# Altium schematic sheet Power Stage.SchDoc
size A4
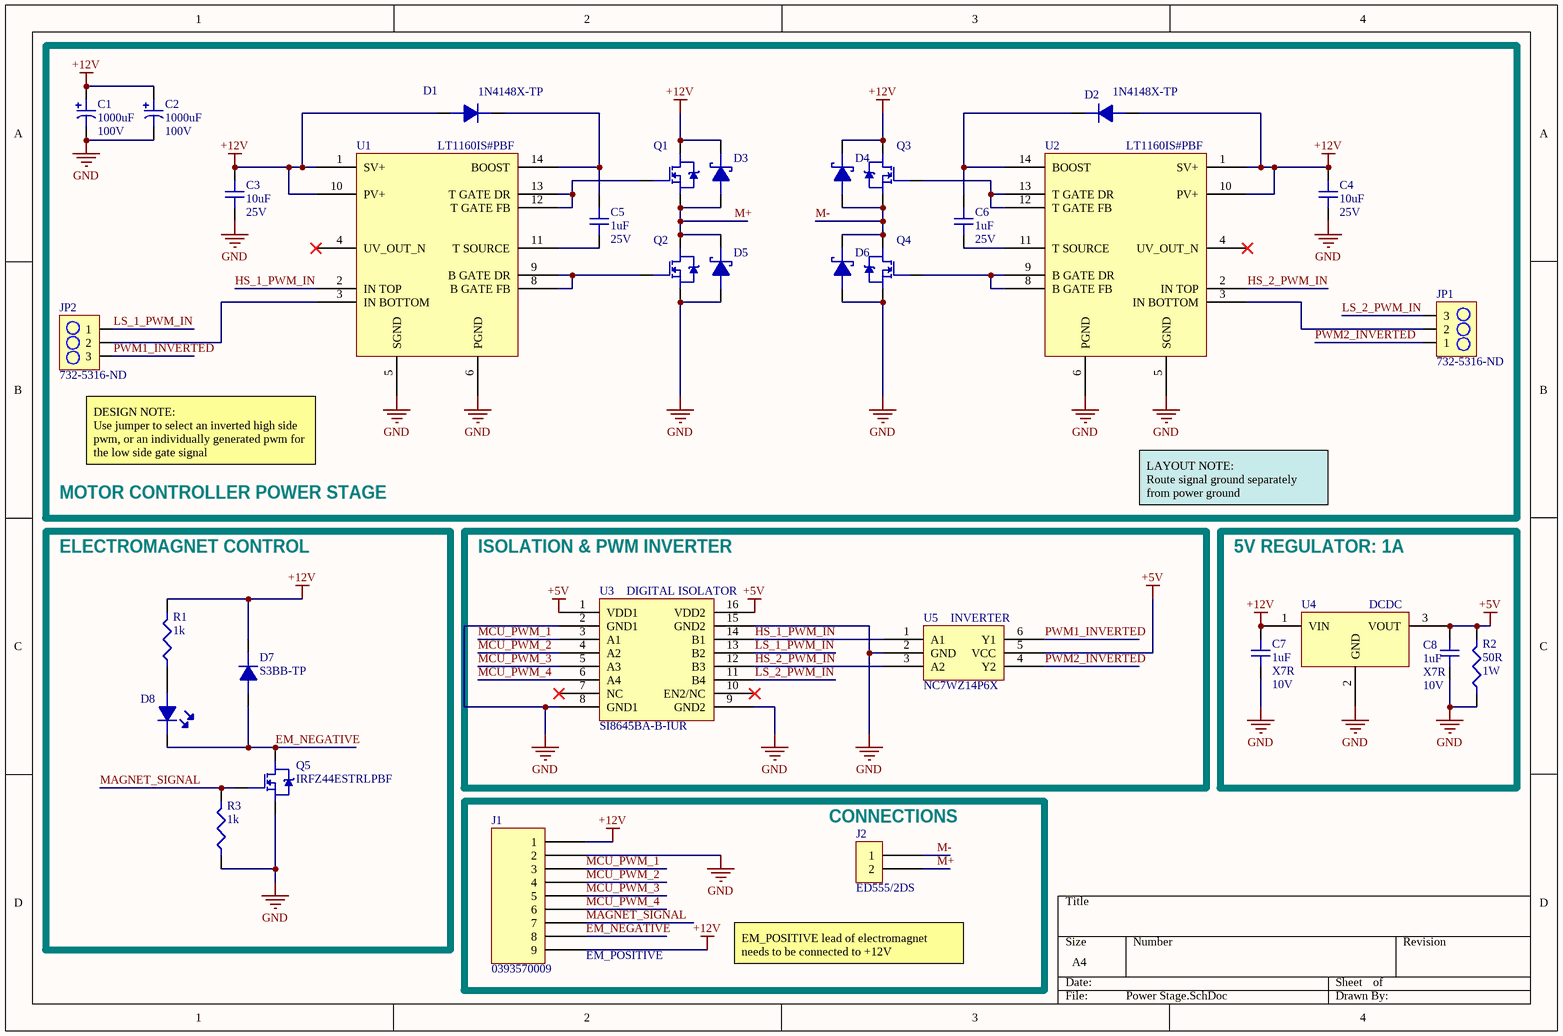
[diagram p0: Power Stage.SchDoc]

## Parts
C1  Capacitance: 1000uF  Voltage Rating: 100V  [CAP_THRU]  (hidden comment: UVR2A102MRD6)
C2  Capacitance: 1000uF  Voltage Rating: 100V  [CAP_THRU]  (hidden comment: UVR2A102MRD6)
C3  Capacitance: 10uF  Voltage Rating: 25V  [C1206]  (hidden comment: C3216X5R1E106K160AB)
C4  Capacitance: 10uF  Voltage Rating: 25V  [C1206]  (hidden comment: C3216X5R1E106K160AB)
C5  Voltage: 25V  [C0805]  (hidden comment: 1uF)
C6  Voltage: 25V  [C0805]  (hidden comment: 1uF)
C7  1uF  Dielectric: X7R  Voltage: 10V  [C0805]
C8  1uF  Dielectric: X7R  Voltage: 10V  [C0805]
D1  1N4148X-TP  [SOD523]
D2  1N4148X-TP  [SOD523]
D3  CDBA540-HF  [DO214-AC]  (value not drawn)
D4  CDBA540-HF  [DO214-AC]  (value not drawn)
D5  CDBA540-HF  [DO214-AC]  (value not drawn)
D6  CDBA540-HF  [DO214-AC]  (value not drawn)
D7  S3BB-TP  [DO-214AA_Diode]
D8  LTST-C191TBKT-5A  [LED_0603]  (value not drawn)
J1  0393570009  [9POS_CONNECTOR]
J2  ED555/2DS  [2POS_CONNECTOR]
JP1  732-5316-ND  [3PIN_HEADER]
JP2  732-5316-ND  [3PIN_HEADER]
Q1  IRFZ44ESTRLPBF  [D2PAK]  (value not drawn)
Q2  IRFZ44ESTRLPBF  [D2PAK]  (value not drawn)
Q3  IRFZ44ESTRLPBF  [D2PAK]  (value not drawn)
Q4  IRFZ44ESTRLPBF  [D2PAK]  (value not drawn)
Q5  IRFZ44ESTRLPBF  [D2PAK]
R1  1k  [R0805]
R2  50R  Power Rating: 1W  [R2512]
R3  1k  [R0805]
U1  LT1160IS#PBF  [SOIC-14]
U2  LT1160IS#PBF  [SOIC-14]
U3  SI8645BA-B-IUR  [QSOP-16]
U4  DCDC  [DCDC]
U5  NC7WZ14P6X  [TSOP-6]

## Blocks framed on the sheet
MOTOR CONTROLLER POWER STAGE: C1-C6 D1-D6 JP1 JP2 Q1-Q4 U1 U2
ELECTROMAGNET CONTROL: D7 D8 Q5 R1 R3
ISOLATION & PWM INVERTER: U3 U5
5V REGULATOR: 1A: C7 C8 R2 U4
CONNECTIONS: J1 J2

## Nets
+5V: C8.2 R2.2 U3.1(VDD1) U3.16(VDD2) U4.3(VOUT) U5.5(VCC)
+12V: C1.1 C2.1 C3.2 C4.2 C7.2 D1.1 D2.1 D3.2 D4.2 D7.2 J1.1 J1.9 Q1.2 Q3.2 R1.2 U1.1(SV+) U1.10(PV+) U2.1(SV+) U2.10(PV+) U4.1(VIN)
GND: C1.2 C2.2 C3.1 C4.1 C7.1 C8.1 D5.1 D6.1 J1.2 Q2.3 Q4.3 Q5.3 R2.1 R3.1 U1.5(SGND) U1.6(PGND) U2.5(SGND) U2.6(PGND) U3.2(GND1) U3.8(GND1) U3.9(GND2) U3.15(GND2) U4.2(GND) U5.2(GND)
EM_NEGATIVE: D7.1 D8.2 J1.8 Q5.2
HS_1_PWM_IN: U1.2(IN_TOP) U3.14(B1) U5.1(A1)
HS_2_PWM_IN: U2.2(IN_TOP) U3.12(B3) U5.3(A2)
LS_1_PWM_IN: JP2.1 U3.13(B2)
LS_2_PWM_IN: JP1.3 U3.11(B4)
M+: D3.1 D5.2 J2.2 Q1.3 Q2.2
M-: D4.1 D6.2 J2.1 Q3.3 Q4.2
MAGNET_SIGNAL: J1.7 Q5.1 R3.2
MCU_PWM_1: J1.3 U3.3(A1)
MCU_PWM_2: J1.4 U3.4(A2)
MCU_PWM_3: J1.5 U3.5(A3)
MCU_PWM_4: J1.6 U3.6(A4)
PWM1_INVERTED: JP2.3 U5.6(Y1)
PWM2_INVERTED: JP1.1 U5.4(Y2)
NetC5_1: C5.1 U1.11(T_SOURCE)
NetC5_2: C5.2 D1.2 U1.14(BOOST)
NetC6_1: C6.1 U2.11(T_SOURCE)
NetC6_2: C6.2 D2.2 U2.14(BOOST)
NetD8_1: D8.1 R1.1
NetJP1_2: JP1.2 U2.3(IN_BOTTOM)
NetJP2_2: JP2.2 U1.3(IN_BOTTOM)
NetQ1_1: Q1.1 U1.12(T_GATE_FB) U1.13(T_GATE_DR)
NetQ2_1: Q2.1 U1.8(B_GATE_FB) U1.9(B_GATE_DR)
NetQ3_1: Q3.1 U2.12(T_GATE_FB) U2.13(T_GATE_DR)
NetQ4_1: Q4.1 U2.8(B_GATE_FB) U2.9(B_GATE_DR)

Not connected (* = marked no-connect by the designer): U1 4(UV_OUT_N)*; U2 4(UV_OUT_N)*; U3 7(NC)* 10(EN2/NC)*

## Notes on the sheet
- DESIGN NOTE:
  Use jumper to select an inverted high side pwm, or an individually generated pwm for the low side gate signal
- LAYOUT NOTE:
  Route signal ground separately from power ground
- (near U3) DIGITAL ISOLATOR
- (near U5) INVERTER
- (near J1) EM_POSITIVE
- EM_POSITIVE lead of electromagnet needs to be connected to +12V

## Library data of the parts
C1 C2 = UVR2A102MRD6: CAP Electrolytic 1000uF 100V; Manufacturer: Nichicon; Tolerance: 20%; Ripple Current: 1.38A; Polarity: Polar; Life (Hours): 2000Hour; Dissipation Factor: 0.08%; Lead/Base Style: Straight; Supplier 1: Digi-Key; Manufacturer Part Number: UVR2A102MRD6; Stock 1: 1438; Pricing 1: 1=1.84, 10=1.492, 100=1.1391, 500=0.8679, 1000=0.7594, 2500=0.7323, 5000=0.7052 (USD); Mount: Through Hole; Case/Package: Radial; Min Operating Temperature: -40°C; Max Operating Temperature: 85°C; Packaging: Bulk; Package Quantity: 50; Voltage Rating (DC): 100V; Termination: Radial; Length: 35mm; Lead Pitch: 7.5mm; ComponentLink1URL: http://www.mouser.com/ds/2/293/e-uvr-1076495.pdf; ComponentLink1Description: http://www.mouser.com/ds/2/293/e-uvr-1076495.pdf; ComponentLink2URL: http://nichicon-us.com/english/products/pdfs/e-uvr.pdf; ComponentLink2Description: http://nichicon-us.com/english/products/pdfs/e-uvr.pdf; Supplier Part Number 1: 493-14310-ND
C3 C4 = C3216X5R1E106K160AB: CAP MLCC 10µF ±10% 25V X5R Ceramic Capacitor -55°C ~ 85°C Surface Mount, MLCC 1206 (3216 Metric) 0.126" L x 0.063" W (3.20mm x 1.60mm); Manufacturer: TDK; Supplier 1: Digi-Key; Manufacturer Part Number: C3216X5R1E106K160AB; Stock 1: 3130; Pricing 1: 1=0.83, 10=0.589, 100=0.3881, 500=0.2875, 1000=0.2444 (USD); Mount: Surface Mount; Case/Package: 1206; Number of Pins: 2; Weight: 0.000571oz; Case Code (Metric): 3216; Case Code (Imperial): 1206; Dielectric Material: Ceramic; Min Operating Temperature: -55°C; Max Operating Temperature: 85°C; Tolerance: 10%; Voltage Rating (DC): 25V; Packaging: Tape and Reel; Package Quantity: 2000; Dielectric: X5R; Termination: SMD/SMT; Composition: Ceramic; Length: 3.2mm; Height: 1.6mm; Width: 0.063inch; Thickness: 0.075inch; Depth: 1.6mm; Radiation Hardening: No; Lead Free: Lead Free; ComponentLink1URL: https://datasheet.ciiva.com/6276/tdkmlcccaprange-6276583.pdf; ComponentLink1Description: https://datasheet.ciiva.com/6276/tdkmlcccaprange-6276583.pdf; ComponentLink2URL: https://datasheet.ciiva.com/17487/e412-c-17487288.pdf; ComponentLink2Description: https://datasheet.ciiva.com/17487/e412-c-17487288.pdf; ComponentLink3URL: https://datasheet.ciiva.com/24217/c3216x5r1e106k160ab-265309-24217784.pdf; ComponentLink3Description: https://datasheet.ciiva.com/24217/c3216x5r1e106k160ab-265309-24217784.pdf; ComponentLink4URL: https://datasheet.ciiva.com/6276/tdkmlcccaprange-6276585.pdf; ComponentLink4Description: https://datasheet.ciiva.com/6276/tdkmlcccaprange-6276585.pdf; ComponentLink5URL: https://datasheet.ciiva.com/6276/tdkmlcccaprange-6276587.pdf; ComponentLink5Description: https://datasheet.ciiva.com/6276/tdkmlcccaprange-6276587.pdf; Supplier Part Number 1: 445-6862-1-ND
C5 C6 = GCM21BR71E105KA56L: CAP MLCC 1UF 25V X7R 0805; Manufacturer: Murata; Tolerance: 10%; Supplier 1: Digi-Key; Manufacturer Part Number: GCM21BR71E105KA56L; Stock 1: 30000; Pricing 1: 1=0.25, 10=0.171, 100=0.0865, 500=0.0592, 1000=0.0524 (USD); Mount: Surface Mount; Case/Package: 0805; Case Code (Metric): 2012; Case Code (Imperial): 0805; Min Operating Temperature: -55°C; Max Operating Temperature: 125°C; Package Quantity: 3000; Voltage Rating: 25V; Packaging: Tape and Reel; Dielectric: X7R; Termination: SMD/SMT; Voltage Rating (DC): 25V; Length: 2mm; Height: 1.25mm; Width: 0.049inch; Thickness: 0.055inch; Depth: 1.25mm; Radiation Hardening: No; REACH SVHC: No SVHC; Lead Free: Lead Free; ComponentLink1URL: https://datasheet.ciiva.com/137/product-137200.pdf; ComponentLink1Description: https://datasheet.ciiva.com/137/product-137200.pdf; ComponentLink2URL: https://datasheet.ciiva.com/3778/359gcm21br71e105ka5623-3778560.pdf; ComponentLink2Description: https://datasheet.ciiva.com/3778/359gcm21br71e105ka5623-3778560.pdf; ComponentLink3URL: https://datasheet.ciiva.com/16624/product-16624576.pdf; ComponentLink3Description: https://datasheet.ciiva.com/16624/product-16624576.pdf; ComponentLink4URL: https://datasheet.ciiva.com/18183/getdatasheetpartid-153106-18183696.pdf; ComponentLink4Description: https://datasheet.ciiva.com/18183/getdatasheetpartid-153106-18183696.pdf; ComponentLink5URL: https://datasheet.ciiva.com/137/product-137201.pdf; ComponentLink5Description: https://datasheet.ciiva.com/137/product-137201.pdf; ComponentLink6URL: https://datasheet.ciiva.com/11789/0900766b80ef92d0-11789092.pdf; ComponentLink6Description: https://datasheet.ciiva.com/11789/0900766b80ef92d0-11789092.pdf; ComponentLink7URL: https://datasheet.ciiva.com/2989/product-2989245.pdf; ComponentLink7Description: https://datasheet.ciiva.com/2989/product-2989245.pdf; ComponentLink8URL: https://datasheet.ciiva.com/2989/product-2989246.pdf; ComponentLink8Description: https://datasheet.ciiva.com/2989/product-2989246.pdf; ComponentLink9URL: https://datasheet.ciiva.com/137/product-137199.pdf; ComponentLink9Description: https://datasheet.ciiva.com/137/product-137199.pdf; Supplier Part Number 1: 490-4785-1-ND; Capacitance: 1uF
C7 C8 = 0805ZC105KAT2A: CAP CER 1UF 10V X7R 0805; Manufacturer: Kyocera AVX; Tolerance: 10%; Dissipation Factor: 5%; Insulation Resistance: 100GR; Supplier 1: Digi-Key; Manufacturer Part Number: 0805ZC105KAT2A; Stock 1: 385183; Pricing 1: 1=0.21, 10=0.147, 100=0.069, 500=0.0484, 1000=0.0401 (USD); Mount: Surface Mount,PCB; Case/Package: 0805; Number of Pins: 2; Case Code (Imperial): 0805; Case Code (Metric): 2012; Contact Plating: Tin,Matte; Min Operating Temperature: -55°C; Max Operating Temperature: 125°C; Capacitance: 1uF; Voltage Rating: 10V; Voltage Rating (DC): 10V; Packaging: Tape and Reel; Package Quantity: 1; Termination: SMD/SMT; Length: 2.01mm; Height: 1.4mm; Width: 1.25mm; Thickness: 0.055inch; Depth: 1.25mm; Radiation Hardening: No; REACH SVHC: No SVHC; Lead Free: Lead Free; ComponentLink1URL: https://datasheet.ciiva.com/2988/cx7r-2988071.pdf; ComponentLink1Description: https://datasheet.ciiva.com/2988/cx7r-2988071.pdf; ComponentLink2URL: https://datasheet.ciiva.com/2988/cx7r-2988072.pdf; ComponentLink2Description: https://datasheet.ciiva.com/2988/cx7r-2988072.pdf; ComponentLink3URL: https://datasheet.ciiva.com/14601/70001075-14601048.pdf; ComponentLink3Description: https://datasheet.ciiva.com/14601/70001075-14601048.pdf; ComponentLink4URL: https://datasheet.ciiva.com/14594/70001075-14594329.pdf; ComponentLink4Description: https://datasheet.ciiva.com/14594/70001075-14594329.pdf; ComponentLink5URL: https://datasheet.ciiva.com/25901/cx7r-25901193.pdf; ComponentLink5Description: https://datasheet.ciiva.com/25901/cx7r-25901193.pdf; ComponentLink6URL: https://datasheet.ciiva.com/15165/getdatasheetpartid-71567-15165451.pdf; ComponentLink6Description: https://datasheet.ciiva.com/15165/getdatasheetpartid-71567-15165451.pdf; ComponentLink7URL: https://datasheet.ciiva.com/151/cx7r-151916.pdf; ComponentLink7Description: https://datasheet.ciiva.com/151/cx7r-151916.pdf; ComponentLink8URL: https://datasheet.ciiva.com/151/cx7r-151917.pdf; ComponentLink8Description: https://datasheet.ciiva.com/151/cx7r-151917.pdf; ComponentLink9URL: https://datasheet.ciiva.com/151/cx7r-151918.pdf; ComponentLink9Description: https://datasheet.ciiva.com/151/cx7r-151918.pdf; ComponentLink10URL: https://datasheet.ciiva.com/11787/0900766b80ed4be2-11787102.pdf; ComponentLink10Description: https://datasheet.ciiva.com/11787/0900766b80ed4be2-11787102.pdf; ComponentLink11URL: https://datasheet.ciiva.com/7812/84526-7812223.pdf; ComponentLink11Description: https://datasheet.ciiva.com/7812/84526-7812223.pdf; ComponentLink12URL: https://datasheet.ciiva.com/19475/2011248-19475855.pdf; ComponentLink12Description: https://datasheet.ciiva.com/19475/2011248-19475855.pdf; Supplier Part Number 1: 478-1405-1-ND
D1 D2 = 1N4148X-TP: DIODE GEN PURP 75V 150MA SOD523; Manufacturer: MCC; Max Surge Current: 2A; Recovery Time: 4ns; Forward Voltage: 1.25V; Forward Current: 300mA; Max Reverse Leakage Current: 1uA; Power Dissipation: 200mW; Max Repetitive Reverse Voltage (Vrrm): 100V; Element Configuration: Single; Polarity: Standard; Capacitance: 2pF; Supplier 1: Digi-Key; Manufacturer Part Number: 1N4148X-TP; Stock 1: 978848; Pricing 1: 1=0.14, 10=0.131, 100=0.0856, 500=0.0419, 1000=0.0285 (USD); Mount: Surface Mount; Number of Pins: 2; Min Operating Temperature: -65°C; Max Operating Temperature: 150°C; Package Quantity: 1; Packaging: Tape and Reel; Average Rectified Current: 150mA; Reverse Recovery Time: 4ns; Peak Non-Repetitive Surge Current: 2A; Voltage Rating (DC): 75V; Current Rating: 150mA; Output Current: 300mA; Max Reverse Voltage (DC): 75V; Radiation Hardening: No; Lead Free: Lead Free; ComponentLink1URL: https://datasheet.ciiva.com/911/1n4148xsod-523-911686.pdf; ComponentLink1Description: https://datasheet.ciiva.com/911/1n4148xsod-523-911686.pdf; ComponentLink2URL: https://datasheet.ciiva.com/4435/1n4148xsod-523-358-4435190.pdf; ComponentLink2Description: https://datasheet.ciiva.com/4435/1n4148xsod-523-358-4435190.pdf; ComponentLink3URL: https://datasheet.ciiva.com/911/1n4148xsod-523-911687.pdf; ComponentLink3Description: https://datasheet.ciiva.com/911/1n4148xsod-523-911687.pdf; ComponentLink4URL: https://datasheet.ciiva.com/911/1n4148xsod-523-911688.pdf; ComponentLink4Description: https://datasheet.ciiva.com/911/1n4148xsod-523-911688.pdf; ComponentLink5URL: https://datasheet.ciiva.com/16836/1n4148xsod-523-16836299.pdf; ComponentLink5Description: https://datasheet.ciiva.com/16836/1n4148xsod-523-16836299.pdf; Supplier Part Number 1: 1N4148XTPMSCT-ND
D3-D6 = CDBA540-HF: DIODE Schottky Diodes & Rectifiers 40V, 5A; Manufacturer: Comchip; Supplier 1: Digi-Key; Manufacturer Part Number: CDBA540-HF; Stock 1: 61079; Pricing 1: 1=0.49, 10=0.381, 100=0.2612, 500=0.1791, 1000=0.1343 (USD); Mount: Surface Mount; Packaging: Tape and Reel; Average Rectified Current: 5A; Max Reverse Voltage (DC): 40V; ComponentLink1URL: http://www.mouser.com/ds/2/80/CDBA520-HF%20Thru134737.%20CDBA5200-HF%20RevB-221146.pdf; ComponentLink1Description: http://www.mouser.com/ds/2/80/CDBA520-HF%20Thru134737.%20CDBA5200-HF%20RevB-221146.pdf; ComponentLink2URL: http://www.comchiptech.com/cms/UserFiles/CDBA540-HF%20Thru505315.%20CDBA5200-HF%20RevC.pdf; ComponentLink2Description: http://www.comchiptech.com/cms/UserFiles/CDBA540-HF%20Thru505315.%20CDBA5200-HF%20RevC.pdf; Supplier Part Number 1: 641-1707-1-ND
D7 = S3BB-TP: DIODE GEN PURP 100V 3A DO214AA; Manufacturer: MCC; Max Surge Current: 100A; Forward Voltage: 1.15V; Peak Reverse Current: 10uA; Element Configuration: Single; Supplier 1: Digi-Key; Manufacturer Part Number: S3BB-TP; Stock 1: 10943; Pricing 1: 1=0.56, 10=0.441, 25=0.372, 100=0.3028, 250=0.2509, 500=0.2076, 1000=0.1557 (USD); Mount: Surface Mount; Number of Pins: 2; Packaging: Tape and Reel; Package Quantity: 1; Reverse Voltage (DC): 100V; Average Rectified Current: 3A; Peak Non-Repetitive Surge Current: 100A; Max Repetitive Reverse Voltage (Vrrm): 100V; Radiation Hardening: No; Lead Free: Lead Free; ComponentLink1URL: https://datasheet.ciiva.com/914/s3ab-s3mbsmb-914278.pdf; ComponentLink1Description: https://datasheet.ciiva.com/914/s3ab-s3mbsmb-914278.pdf; ComponentLink2URL: https://datasheet.ciiva.com/914/s3ab-s3mbsmb-914279.pdf; ComponentLink2Description: https://datasheet.ciiva.com/914/s3ab-s3mbsmb-914279.pdf; ComponentLink3URL: https://datasheet.ciiva.com/914/s3ab-s3mbsmb-914280.pdf; ComponentLink3Description: https://datasheet.ciiva.com/914/s3ab-s3mbsmb-914280.pdf; ComponentLink4URL: https://datasheet.ciiva.com/15200/getdatasheetpartid-686538-15200554.pdf; ComponentLink4Description: https://datasheet.ciiva.com/15200/getdatasheetpartid-686538-15200554.pdf; ComponentLink5URL: https://datasheet.ciiva.com/17437/s3ab-s3mbsmb-17437836.pdf; ComponentLink5Description: https://datasheet.ciiva.com/17437/s3ab-s3mbsmb-17437836.pdf; Supplier Part Number 1: S3BB-TPMSCT-ND
D8 = LTST-C191TBKT-5A: LED BLUE CLEAR 0603 SMD; Manufacturer: Vishay Lite-On; Lens Colour: Colorless; Lens Style: Diffused,Colorless,Rectangular; Viewing Angle: 130°; Forward Current: 20mA; Forward Voltage: 2.8V; Luminous Intensity: 15mcd; Test Current: 5mA; Dominant Wavelength: 473nm; Number of LEDs: 1; Voltage: 29V; Supplier 1: Digi-Key; Manufacturer Part Number: LTST-C191TBKT-5A; Stock 1: 2918; Pricing 1: 1=0.52, 10=0.376, 25=0.2884, 100=0.1881, 250=0.138, 500=0.117, 1000=0.0961, 2500=0.0836 (USD); Mount: Surface Mount; Case/Package: 0603; Colour: Blue; Case Code (Metric): 1608; Case Code (Imperial): 0603; Min Operating Temperature: -20°C; Max Operating Temperature: 80°C; Packaging: Tape and Reel; Package Quantity: 5000; Illumination Colour: Blue; Lens Transparency: Clear; Length: 1.6mm; Height: 0.55mm; Width: 0.8mm; Radiation Hardening: No; ComponentLink1URL: http://components.arrow.com/part/dataview/52218576S9813001N1331; ComponentLink1Description: http://components.arrow.com/part/dataview/52218576S9813001N1331; ComponentLink2URL: http://optoelectronics.liteon.com/zh-cn/api/DwonloadFileHandler.ashx?txtSpecNo=DS22-2003-020&txtPartNo=LTST-C191TBKT-5A; ComponentLink2Description: http://optoelectronics.liteon.com/zh-cn/api/DwonloadFileHandler.ashx?txtSpecNo=DS22-2003-020&txtPartNo=LTST-C191TBKT-5A; Supplier Part Number 1: 160-2212-6-ND
J1 = 0393570009: CONN TERMINAL BLOCK 9POS 3.5MM; Manufacturer: Molex; Plating: Nickel; Number of Levels: 1; Number of Positions Per Level: 9; Current: 12A; Voltage: 300V; Wire Gauge (Max): 28AWG; Wire Gauge (Min): 16AWG; Pitch: 0.138inch; Supplier 1: Digi-Key; Manufacturer Part Number: 0393570009; Stock 1: 4496; Pricing 1: 1=3.12, 10=2.362, 25=2.1888, 50=1.968, 100=1.92, 250=1.68, 500=1.536, 1000=1.392, 5000=1.224 (USD); Mount: Through Hole; Colour: Black; Contact Plating: Tin; Housing Colour: Black; Housing Material: Nylon; Min Operating Temperature: -40°C; Max Operating Temperature: 105°C; Number of Rows: 1; Packaging: Bulk; Termination: Screw; Number of Contacts: 9; Orientation: Straight; ComponentLink1URL: https://datasheet.ciiva.com/9364/0393570009-terminal-blocks-9364872.pdf; ComponentLink1Description: https://datasheet.ciiva.com/9364/0393570009-terminal-blocks-9364872.pdf; ComponentLink2URL: https://datasheet.ciiva.com/18620/393570005-sd-18620844.pdf; ComponentLink2Description: https://datasheet.ciiva.com/18620/393570005-sd-18620844.pdf; Supplier Part Number 1: WM7865-ND
J2 = ED555/2DS: TERMINAL BLOCK 3.5MM 2POS PCB; Manufacturer: On-Shore Technology; Plating: Steel; Number of Levels: 1; Number of Positions Per Level: 2; Current: 6A; Voltage: 150V; Pitch: 0.138inch; Wire Gauge (Max): 28AWG; Wire Gauge (Min): 16AWG; Supplier 1: Digi-Key; Manufacturer Part Number: ED555/2DS; Stock 1: 38938; Pricing 1: 1=1.06, 10=0.658, 25=0.5632, 50=0.5064, 100=0.4959, 250=0.422, 500=0.4009, 1000=0.3587, 5000=0.2806 (USD); Mount: Through Hole; Number of Pins: 2; Colour: Grey; Contact Plating: Brass; Contact Material: Brass; Housing Colour: Grey; Housing Material: Nylon; Min Operating Temperature: -30°C; Max Operating Temperature: 105°C; Packaging: Bulk; Termination: Screw; Number of Positions: 2; Number of Rows: 1; Length: 7mm; Height: 8.2mm; Width: 6.2mm; Lead Free: Lead Free; Flammability Rating: UL94 V-0; ComponentLink1URL: https://datasheet.ciiva.com/823/ed555ds-823583.pdf; ComponentLink1Description: https://datasheet.ciiva.com/823/ed555ds-823583.pdf; Supplier Part Number 1: ED1514-ND
JP1 JP2 = 61300311121: CONN_HeaderPins3pos WURTH ELEKTRONIK Board-To-Board Connector, Vertical, WR-PHD Series, Through Hole, Header, 3 Contacts, 2.54 mm; Manufacturer: Wurth Electronics; Number of Positions: 3; Gender: Male; Connector Type: Male Pin; Pitch: 0.1inch; Supplier 1: Digi-Key; Manufacturer Part Number: 61300311121; Stock 1: 57026; Pricing 1: 1=0.13, 10=0.106, 25=0.088, 50=0.074, 100=0.067, 1000=0.061 (USD); Mount: Through Hole; Case/Package: 100; Contact Plating: Gold; Contact Material: Copper; Colour: Black; Number of Rows: 1; Packaging: Bulk; Termination: Solder; Number of Contacts: 3; Contact Mating Length: 0.236inch; REACH SVHC: Unknown; Lead Free: Lead Free; ComponentLink1URL: http://www.farnell.com/cad/1737268.pdf; ComponentLink1Description: http://www.farnell.com/cad/1737268.pdf; Supplier Part Number 1: 732-5316-ND
Q1-Q5 = IRFZ44ESTRLPBF: MOSFET N-CH 60V 48A D2PAK; Manufacturer: Infineon; Rds On Max: 23mR; Input Capacitance: 1.36nF; Max Power Dissipation: 110W; Gate to Source Voltage (Vgs): 20V; Rise Time: 60ns; Turn-Off Delay Time: 70ns; Turn-On Delay Time: 12ns; Supplier 1: Digi-Key; Manufacturer Part Number: IRFZ44ESTRLPBF; Stock 1: 600; Pricing 1: 1=1.61, 10=1.43, 100=1.1304 (USD); Mount: Surface Mount; Case/Package: TO-263-3; Number of Pins: 3; Contact Plating: Tin,Matte; Min Operating Temperature: -55°C; Max Operating Temperature: 175°C; Packaging: Tape and Reel; Drain to Source Voltage (Vdss): 60V; Continuous Drain Current (ID): 48A; Power Dissipation: 110W; Drain to Source Resistance: 23mR; Drain to Source Breakdown Voltage: 60V; Length: 0.42inch; Height: 0.19inch; Width: 0.38inch; Lead Free: Lead Free; ComponentLink1URL: https://www.alliedelec.com/m/d/1b68331d905676b420cb8944ec9d0bc2.pdf; ComponentLink1Description: https://www.alliedelec.com/m/d/1b68331d905676b420cb8944ec9d0bc2.pdf; ComponentLink2URL: http://www.infineon.com/dgdl/irfz44espbf.pdf?fileId=5546d462533600a40153563b2c662208; ComponentLink2Description: http://www.infineon.com/dgdl/irfz44espbf.pdf?fileId=5546d462533600a40153563b2c662208; ComponentLink3URL: http://www.irf.com/product-info/datasheets/data/irfz44espbf.pdf; ComponentLink3Description: http://www.irf.com/product-info/datasheets/data/irfz44espbf.pdf; Supplier Part Number 1: IRFZ44ESTRLPBFCT-ND
R1 R3 = ERA-6AEB102V: RES SMD 1K OHM 0805 1K Ohm 0.1% 0.125W(1/8W) ±25ppm/C Molded SMD Automotive Punched T/R; Manufacturer: Panasonic ECG; Voltage Rating: 100V; Resistance: 1kR; Power Rating: 125mW; Temperature Coefficient: 25ppm/°C; Supplier 1: Digi-Key; Manufacturer Part Number: ERA-6AEB102V; Stock 1: 506583; Pricing 1: 1=0.36, 10=0.302, 100=0.1182, 1000=0.0495, 2500=0.0454 (USD); Mount: Surface Mount; Case/Package: 0805; Number of Pins: 2; Case Code (Metric): 2012; Case Code (Imperial): 0805; Contact Plating: Tin; Min Operating Temperature: -55°C; Max Operating Temperature: 155°C; Packaging: Tape and Reel; Tolerance: 0.1%; Package Quantity: 5000; Composition: Thin Film; Number of Terminations: 2; Military Standard: Not; Termination: SMD/SMT; Max Power Dissipation: 125mW; Length: 2mm; Height: 0.5mm; Width: 1.25mm; Depth: 1.25mm; Radiation Hardening: No; REACH SVHC: No SVHC; ComponentLink1URL: https://datasheet.ciiva.com/11811/0900766b80beefcc-11811155.pdf; ComponentLink1Description: https://datasheet.ciiva.com/11811/0900766b80beefcc-11811155.pdf; ComponentLink2URL: https://datasheet.ciiva.com/30057/54aoa0000ce26-30057591.pdf; ComponentLink2Description: https://datasheet.ciiva.com/30057/54aoa0000ce26-30057591.pdf; ComponentLink3URL: https://datasheet.ciiva.com/48536/era-eng-tds-48536727.pdf; ComponentLink3Description: https://datasheet.ciiva.com/48536/era-eng-tds-48536727.pdf; ComponentLink4URL: https://datasheet.ciiva.com/9198/aoa0000ce26-9198984.pdf; ComponentLink4Description: https://datasheet.ciiva.com/9198/aoa0000ce26-9198984.pdf; ComponentLink5URL: https://datasheet.ciiva.com/16782/70068849-16782808.pdf; ComponentLink5Description: https://datasheet.ciiva.com/16782/70068849-16782808.pdf; ComponentLink6URL: https://datasheet.ciiva.com/24025/aoa0000ce26-197354-24025849.pdf; ComponentLink6Description: https://datasheet.ciiva.com/24025/aoa0000ce26-197354-24025849.pdf; ComponentLink7URL: https://datasheet.ciiva.com/43455/485442-43455257.pdf; ComponentLink7Description: https://datasheet.ciiva.com/43455/485442-43455257.pdf; ComponentLink8URL: https://datasheet.ciiva.com/43457/485442-43457803.pdf; ComponentLink8Description: https://datasheet.ciiva.com/43457/485442-43457803.pdf; ComponentLink9URL: https://datasheet.ciiva.com/7942/485442-7942414.pdf; ComponentLink9Description: https://datasheet.ciiva.com/7942/485442-7942414.pdf; ComponentLink10URL: https://datasheet.ciiva.com/16201/aoa0000ce26-16201486.pdf; ComponentLink10Description: https://datasheet.ciiva.com/16201/aoa0000ce26-16201486.pdf; ComponentLink11URL: https://datasheet.ciiva.com/22783/485442-22783806.pdf; ComponentLink11Description: https://datasheet.ciiva.com/22783/485442-22783806.pdf; ComponentLink12URL: https://datasheet.ciiva.com/7942/485442-7942415.pdf; ComponentLink12Description: https://datasheet.ciiva.com/7942/485442-7942415.pdf; ComponentLink13URL: https://datasheet.ciiva.com/29184/453027-da-01-en-widerstand-0805-era-29184108.pdf; ComponentLink13Description: https://datasheet.ciiva.com/29184/453027-da-01-en-widerstand-0805-era-29184108.pdf; Supplier Part Number 1: P1.0KDACT-ND
R2 = WSC251550R00FEA: RES SMD 50 OHM 1% 1W 2515; Manufacturer: Vishay Dale; Voltage Rating: 7.1V; Temperature Coefficient: 20ppm/°C; Voltage Rating (DC): 7.07V; Supplier 1: Digi-Key; Manufacturer Part Number: WSC251550R00FEA; Stock 1: 8237; Pricing 1: 1=1.67, 10=1.482, 25=1.3744, 50=1.2936, 100=1.1319, 250=0.9702, 500=0.8085, 1000=0.7007 (USD); Case/Package: 2515; Case Code (Imperial): 2515; Case Code (Metric): 6438; Contact Plating: Tin,Matte; Min Operating Temperature: -65°C; Max Operating Temperature: 275°C; Package Quantity: 1; Resistance: 50R; Tolerance: 1%; Packaging: Tape and Reel; Composition: Wirewound; Military Standard: Not; Number of Terminations: 2; Max Power Dissipation: 1W; Length: 6.35mm; Height: 0.125inch; Width: 0.15inch; Depth: 3.81mm; Radiation Hardening: No; REACH SVHC: No SVHC; Lead Free: Lead Free; ComponentLink1URL: https://datasheet.ciiva.com/2484/wscwsn-2484608.pdf; ComponentLink1Description: https://datasheet.ciiva.com/2484/wscwsn-2484608.pdf; ComponentLink2URL: https://datasheet.ciiva.com/2484/wscwsn-2484609.pdf; ComponentLink2Description: https://datasheet.ciiva.com/2484/wscwsn-2484609.pdf; ComponentLink3URL: https://datasheet.ciiva.com/11812/0900766b80d9a4e3-11812404.pdf; ComponentLink3Description: https://datasheet.ciiva.com/11812/0900766b80d9a4e3-11812404.pdf; ComponentLink4URL: https://datasheet.ciiva.com/7702/wscwsn-7702439.pdf; ComponentLink4Description: https://datasheet.ciiva.com/7702/wscwsn-7702439.pdf; ComponentLink5URL: https://datasheet.ciiva.com/16510/wscwsn-16510183.pdf; ComponentLink5Description: https://datasheet.ciiva.com/16510/wscwsn-16510183.pdf; ComponentLink6URL: https://datasheet.ciiva.com/9002/wscwsn-9002776.pdf; ComponentLink6Description: https://datasheet.ciiva.com/9002/wscwsn-9002776.pdf; ComponentLink7URL: https://datasheet.ciiva.com/22696/1911141-22696987.pdf; ComponentLink7Description: https://datasheet.ciiva.com/22696/1911141-22696987.pdf; ComponentLink8URL: https://datasheet.ciiva.com/28658/1748041-28658109.pdf; ComponentLink8Description: https://datasheet.ciiva.com/28658/1748041-28658109.pdf; ComponentLink9URL: https://datasheet.ciiva.com/16513/wscwsn-16513037.pdf; ComponentLink9Description: https://datasheet.ciiva.com/16513/wscwsn-16513037.pdf; ComponentLink10URL: https://datasheet.ciiva.com/2484/wscwsn-2484607.pdf; ComponentLink10Description: https://datasheet.ciiva.com/2484/wscwsn-2484607.pdf; Supplier Part Number 1: WSCB-50CT-ND
U1 U2 = LT1160IS#PBF: IC PWR MOSFET DRIVER N-CH 14SOIC; Manufacturer: Analog Devices / Linear Technology; Number of Outputs: 2; Operating Supply Voltage: 12V; Min Supply Voltage: 10V; Max Supply Voltage: 15V; Rise Time: 200ns; Max Output Current: 1.5A; Fall Time: 140ns; Turn-Off Delay Time: 600ns; Turn-On Delay Time: 500ns; Supplier 1: Digi-Key; Manufacturer Part Number: LT1160IS#PBF; Stock 1: 838; Pricing 1: 1=6.66, 25=4.4244, 100=3.774 (USD); Case/Package: S; Number of Pins: 14; Min Operating Temperature: -40°C; Max Operating Temperature: 85°C; Package Quantity: 55; Packaging: Rail/Tube; Number of Drivers: 2; Radiation Hardening: No; Lead Free: Lead Free; ComponentLink1URL: https://datasheet.ciiva.com/1951/1303-1951985.pdf; ComponentLink1Description: https://datasheet.ciiva.com/1951/1303-1951985.pdf; ComponentLink2URL: https://datasheet.ciiva.com/15110/getdatasheetpartid-365202-15110225.pdf; ComponentLink2Description: https://datasheet.ciiva.com/15110/getdatasheetpartid-365202-15110225.pdf; Supplier Part Number 1: LT1160IS#PBF-ND
U3 = SI8645BA-B-IUR: IC DIGITAL ISOLATOR 4CHANNEL 150MBPS 1000VRMS ISOLATION NO ISOLATED POWER; Manufacturer: Silicon Labs; Number of Channels: 4; Propagation Delay: 13ns; Channel Type: Unidirectional; Pulse Width Distortion (PWD): 4.5ns; Supplier 1: Digi-Key; Manufacturer Part Number: SI8645BA-B-IUR; Stock 1: 2500; Pricing 1: 1=2.51, 25=2.4208, 100=2.3278 (USD); Case/Package: SSOP; Number of Pins: 16; Weight: 0.002931oz; Min Operating Temperature: -40°C; Max Operating Temperature: 125°C; Package Quantity: 2500; Packaging: Tape and Reel; Data Rate: 150Mbps; Isolated Power: No; Type: General Purpose; ComponentLink1URL: https://datasheet.ciiva.com/8124/si864x-8124729.pdf; ComponentLink1Description: https://datasheet.ciiva.com/8124/si864x-8124729.pdf; ComponentLink2URL: https://datasheet.ciiva.com/15272/si864x-15272845.pdf; ComponentLink2Description: https://datasheet.ciiva.com/15272/si864x-15272845.pdf; Supplier Part Number 1: SI8645BA-B-IURCT-ND
U4 = R-78E5.0-1.0: Non-Isolated DC/DC Converters 8-28Vin 5V 1.0A THRU; Manufacturer: Recom; Number of Outputs: 1; Min Input Voltage: 8V; Max Input Voltage: 28V; Max Output Current: 1A; Efficiency: 91%; Max Power Dissipation: 5W; Supplier 1: Digi-Key; Manufacturer Part Number: R-78E5.0-1.0; Stock 1: 12508; Pricing 1: 1=3.26, 5=3.208, 10=3.162, 25=3.0692, 50=2.976, 100=2.883, 250=2.79, 500=2.604 (USD); Mount: Through Hole; Case/Package: SIP; Weight: 2g; Min Operating Temperature: -40°C; Max Operating Temperature: 85°C; Packaging: Rail/Tube; Voltage - Output 1: 5V; Output Power: 5W; Current - Output 1: 1A; Package Quantity: 42; Max Output Voltage: 5V; Length: 11.6mm; Height: 10.4mm; Width: 8.5mm; Lead Free: Lead Free; ComponentLink1URL: http://www.farnell.com/datasheets/2290573.pdf; ComponentLink1Description: http://www.farnell.com/datasheets/2290573.pdf; ComponentLink2URL: http://www.mouser.com/ds/2/468/R-78Exx-1.0-958279.pdf; ComponentLink2Description: http://www.mouser.com/ds/2/468/R-78Exx-1.0-958279.pdf; ComponentLink3URL: https://www.recom-power.com/pdf/Innoline/R-78Exx-1.0.pdf; ComponentLink3Description: https://www.recom-power.com/pdf/Innoline/R-78Exx-1.0.pdf; Supplier Part Number 1: 945-2201-ND
U5 = NC7WZ14P6X: IC INVERTER DUAL SCHMITT SC70-6; Manufacturer: ON Semiconductor / Fairchild; Logic Function: Schmitt Trigger,Buffer,Inverter; Number of Elements: 2; Propagation Delay: 4.9ns; Max Supply Voltage: 5.5V; Min Supply Voltage: 1.65V; Output Current: 32mA; Number of Inputs: 1; Quiescent Current: 1uA; High Level Output Current: -32mA; Turn-On Delay Time: 14.5ns; Schmitt Trigger Input: Yes; Supplier 1: Digi-Key; Manufacturer Part Number: NC7WZ14P6X; Stock 1: 0; Mount: Surface Mount; Case/Package: SC; Number of Pins: 6; Weight: 0.028g; Contact Plating: Tin,Matte; Min Operating Temperature: -40°C; Max Operating Temperature: 85°C; Packaging: Tape and Reel; Package Quantity: 3000; Number of Circuits: 2; Low Level Output Current: 32mA; Number of Gates: 2; Length: 2mm; Height: 1mm; Width: 1.25mm; Radiation Hardening: No; REACH SVHC: No SVHC; Lead Free: Lead Free; ComponentLink1URL: https://datasheet.ciiva.com/4827/nc7wz14-116143-4827508.pdf; ComponentLink1Description: https://datasheet.ciiva.com/4827/nc7wz14-116143-4827508.pdf; ComponentLink2URL: https://datasheet.ciiva.com/28416/1725703-28416486.pdf; ComponentLink2Description: https://datasheet.ciiva.com/28416/1725703-28416486.pdf; ComponentLink3URL: https://datasheet.ciiva.com/34301/874592-34301639.pdf; ComponentLink3Description: https://datasheet.ciiva.com/34301/874592-34301639.pdf; ComponentLink4URL: https://datasheet.ciiva.com/1861/nc7wz14-1861995.pdf; ComponentLink4Description: https://datasheet.ciiva.com/1861/nc7wz14-1861995.pdf; ComponentLink5URL: https://datasheet.ciiva.com/1861/nc7wz14-1861996.pdf; ComponentLink5Description: https://datasheet.ciiva.com/1861/nc7wz14-1861996.pdf; ComponentLink6URL: https://datasheet.ciiva.com/8248/nc7wz14-8248844.pdf; ComponentLink6Description: https://datasheet.ciiva.com/8248/nc7wz14-8248844.pdf; ComponentLink7URL: https://datasheet.ciiva.com/1861/nc7wz14-1861997.pdf; ComponentLink7Description: https://datasheet.ciiva.com/1861/nc7wz14-1861997.pdf; ComponentLink8URL: https://datasheet.ciiva.com/15089/getdatasheetpartid-110323-15089229.pdf; ComponentLink8Description: https://datasheet.ciiva.com/15089/getdatasheetpartid-110323-15089229.pdf; ComponentLink9URL: https://datasheet.ciiva.com/8248/nc7wz14-8248846.pdf; ComponentLink9Description: https://datasheet.ciiva.com/8248/nc7wz14-8248846.pdf; ComponentLink10URL: https://datasheet.ciiva.com/25628/0900766b80d1df42-25628686.pdf; ComponentLink10Description: https://datasheet.ciiva.com/25628/0900766b80d1df42-25628686.pdf; Supplier Part Number 1: NC7WZ14P6XTR-ND